# EAGLE design production (EAGLE 6.4)
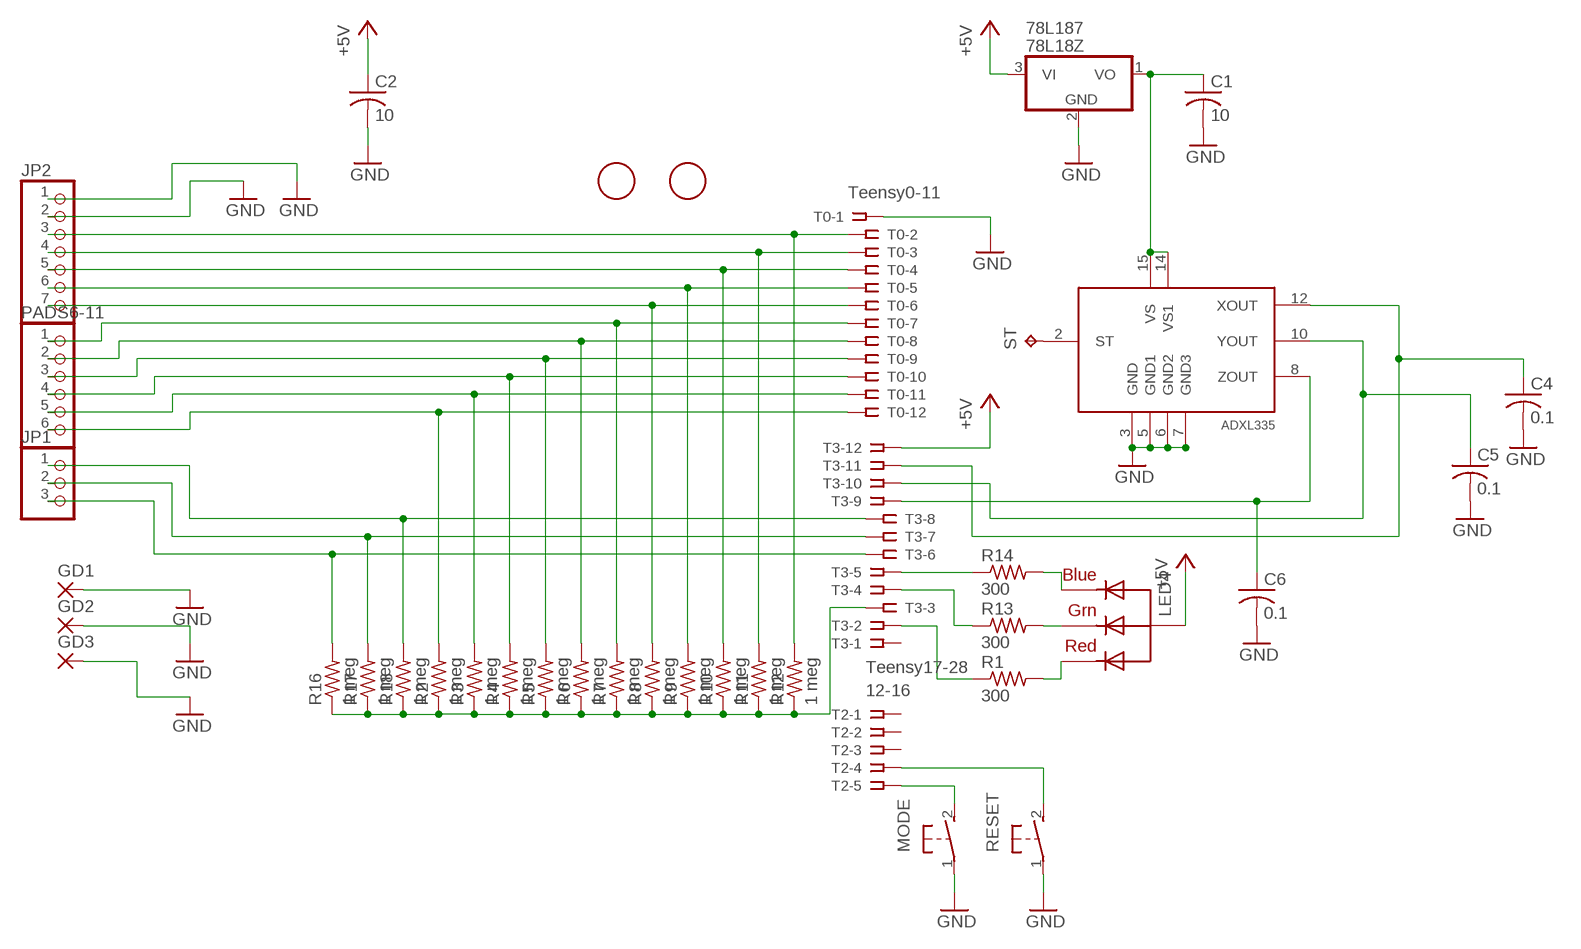
[diagram p0: schematic, sheet 1]

## Parts
78L187  78L18Z  [TO92]
ADXL335  ADXL33X  [16LCSP]
C1  10  C-US050-024X044  [C050-024X044]
C2  10  C-US050-024X044  [C050-024X044]
C4  0.1  C-US050-024X044  [C050-024X044]
C5  0.1  C-US050-024X044  [C050-024X044]
C6  0.1  C-US050-024X044  [C050-024X044]
FID1  FIDUCIAL  [FIDUCIAL_1MM]
FID2  FIDUCIAL  [FIDUCIAL_1MM]
GD1  3,17/1,1  [3,17/1,1]
GD2  3,17/1,1  [3,17/1,1]
GD3  3,17/1,1  [3,17/1,1]
JP1  PINHD-1X3  [1X03]
JP2  PINHD-1X7  [1X07]
LED4  RGBLED_CA-5MM  [LED5MMRGB]
MODE  31-XX  [B3F-31XX]
PADS6-11  PINHD-1X6  [1X06]
R1  300  R-US_0207/2V  [0207/2V]
R2  1 meg  R-US_0207/2V  [0207/2V]
R3  1 meg  R-US_0207/2V  [0207/2V]
R4  1 meg  R-US_0207/2V  [0207/2V]
R5  1 meg  R-US_0207/2V  [0207/2V]
R6  1 meg  R-US_0207/2V  [0207/2V]
R7  1 meg  R-US_0207/2V  [0207/2V]
R8  1 meg  R-US_0207/2V  [0207/2V]
R9  1 meg  R-US_0207/2V  [0207/2V]
R10  1 meg  R-US_0207/2V  [0207/2V]
R11  1 meg  R-US_0207/2V  [0207/2V]
R12  1 meg  R-US_0207/2V  [0207/2V]
R13  300  R-US_0207/2V  [0207/2V]
R14  300  R-US_0207/2V  [0207/2V]
R16  1 meg  R-US_0207/2V  [0207/2V]
R17  1 meg  R-US_0207/2V  [0207/2V]
R18  1 meg  R-US_0207/2V  [0207/2V]
RESET  31-XX  [B3F-31XX]
ST  TPTP17R  [TP17R]
T0  Teensy0-11  SSW-112-02-S-S  [SSW-112-02-S-S]
T2  12-16  SSW-105-02-S-S  [SSW-105-02-S-S]
T3  Teensy17-28  SSW-112-02-S-S  [SSW-112-02-S-S]

## Nets
+5V: 78L187.3(VI) C2.1 LED4.2(VCC) T3.12
GND: 78L187.2(GND) ADXL335.3(GND) ADXL335.5(GND1) ADXL335.6(GND2) ADXL335.7(GND3) C1.2 C2.2 C4.2 C5.2 C6.2 GD1.1(P) GD2.1(P) GD3.1(P) JP2.1 JP2.2 MODE.1(P) RESET.1(P) T0.1
N$1: JP2.3 R12.2 T0.2
N$2: JP2.4 R11.2 T0.3
N$3: PADS6-11.1 R7.2 T0.7
N$4: PADS6-11.2 R6.2 T0.8
N$5: PADS6-11.3 R5.2 T0.9
N$6: PADS6-11.4 R4.2 T0.10
N$7: PADS6-11.5 R3.2 T0.11
N$8: R14.1 T3.5
N$9: JP2.6 R9.2 T0.5
N$10: JP2.5 R10.2 T0.4
N$11: ADXL335.12(XOUT) C4.1 T3.11
N$12: PADS6-11.6 R2.2 T0.12
N$13: LED4.4(BLUE) R14.2
N$14: ADXL335.2(ST) ST.TP
N$16: ADXL335.8(ZOUT) C6.1 T3.9
N$17: LED4.3(GREEN) R13.2
N$18: JP1.3 R16.2 T3.6
N$19: JP1.2 R17.2 T3.7
N$20: JP1.1 R18.2 T3.8
N$21: R2.1 R3.1 R4.1 R5.1 R6.1 R7.1 R8.1 R9.1 R10.1 R11.1 R12.1 R16.1 R17.1 R18.1 T3.3
N$22: R13.1 T3.4
N$23: R1.1 T3.2
N$24: JP2.7 R8.2 T0.6
N$25: LED4.1(RED) R1.2
N$26: ADXL335.10(YOUT) C5.1 T3.10
N$27: MODE.2(S) T2.5
N$28: RESET.2(S) T2.4
VS1: 78L187.1(VO) ADXL335.14(VS1) ADXL335.15(VS) C1.1
Unconnected: T2.1 T2.2 T2.3 T3.1

## Library data of the parts
78L187 = adafruit:78*: Positive VOLTAGE REGULATOR Added bigger pads to the TO-92 package
ADXL335 = adafruit:ADXL33X
C1 C2 C4-C6 = adafruit:C-US: CAPACITOR, American symbol
FID1 FID2 = adafruit:FIDUCIAL: For use by pick and place machines to calibrate the vision/machine, 1mm By microbuilder.eu
GD1-GD3 = wirepad:3,17/1,1: THROUGH-HOLE PAD
JP1 = pinhead:PINHD-1X3: PIN HEADER
JP2 = pinhead:PINHD-1X7: PIN HEADER
LED4 = adafruit:RGBLED_CA: RGB LED, common-anode 5MM Staggered pins 5mm Piranha package http://www.ladyada.net/library/pcb/eaglelibrary.html
MODE RESET = switch-omron:31-XX: OMRON SWITCH; MPN: B3F-3100; OC_FARNELL: 959704; OC_NEWARK: 36M3582
PADS6-11 = pinhead:PINHD-1X6: PIN HEADER
R1-R14 R16-R18 = resistor:R-US_: RESISTOR, American symbol
ST = testpad:TP: Test pad
T0 T3 = con-samtec:SSW-112-02-S-S: THROUGH-HOLE .025" SQ POST SOCKET Source: Samtec SSW.pdf; MPN: SSW-112-02-S-S; OC_FARNELL: unknown; OC_NEWARK: 11P9515
T2 = con-samtec:SSW-105-02-S-S: THROUGH-HOLE .025" SQ POST SOCKET Source: Samtec SSW.pdf; MPN: SSW-105-02-S-S; OC_FARNELL: unknown; OC_NEWARK: 11P9399

## Net classes
0 default: clearance 0.355 mm

## Board
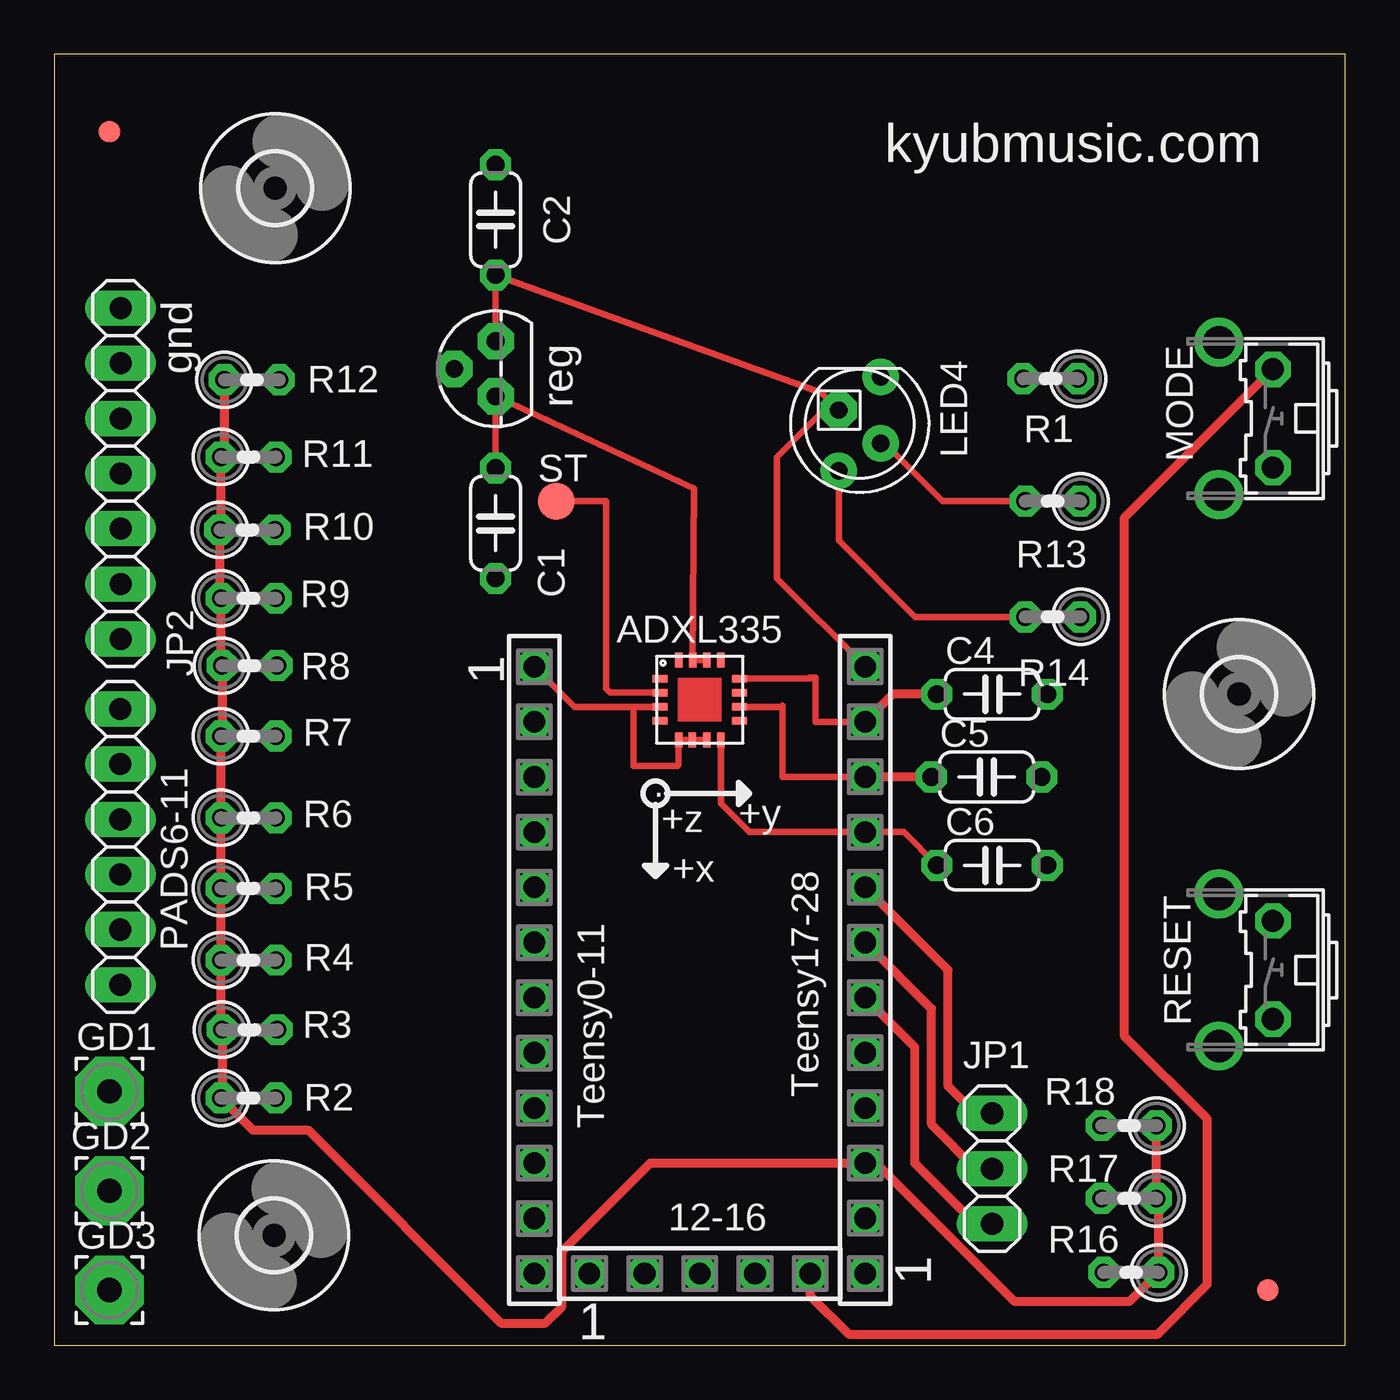
[diagram p1: board, top side]
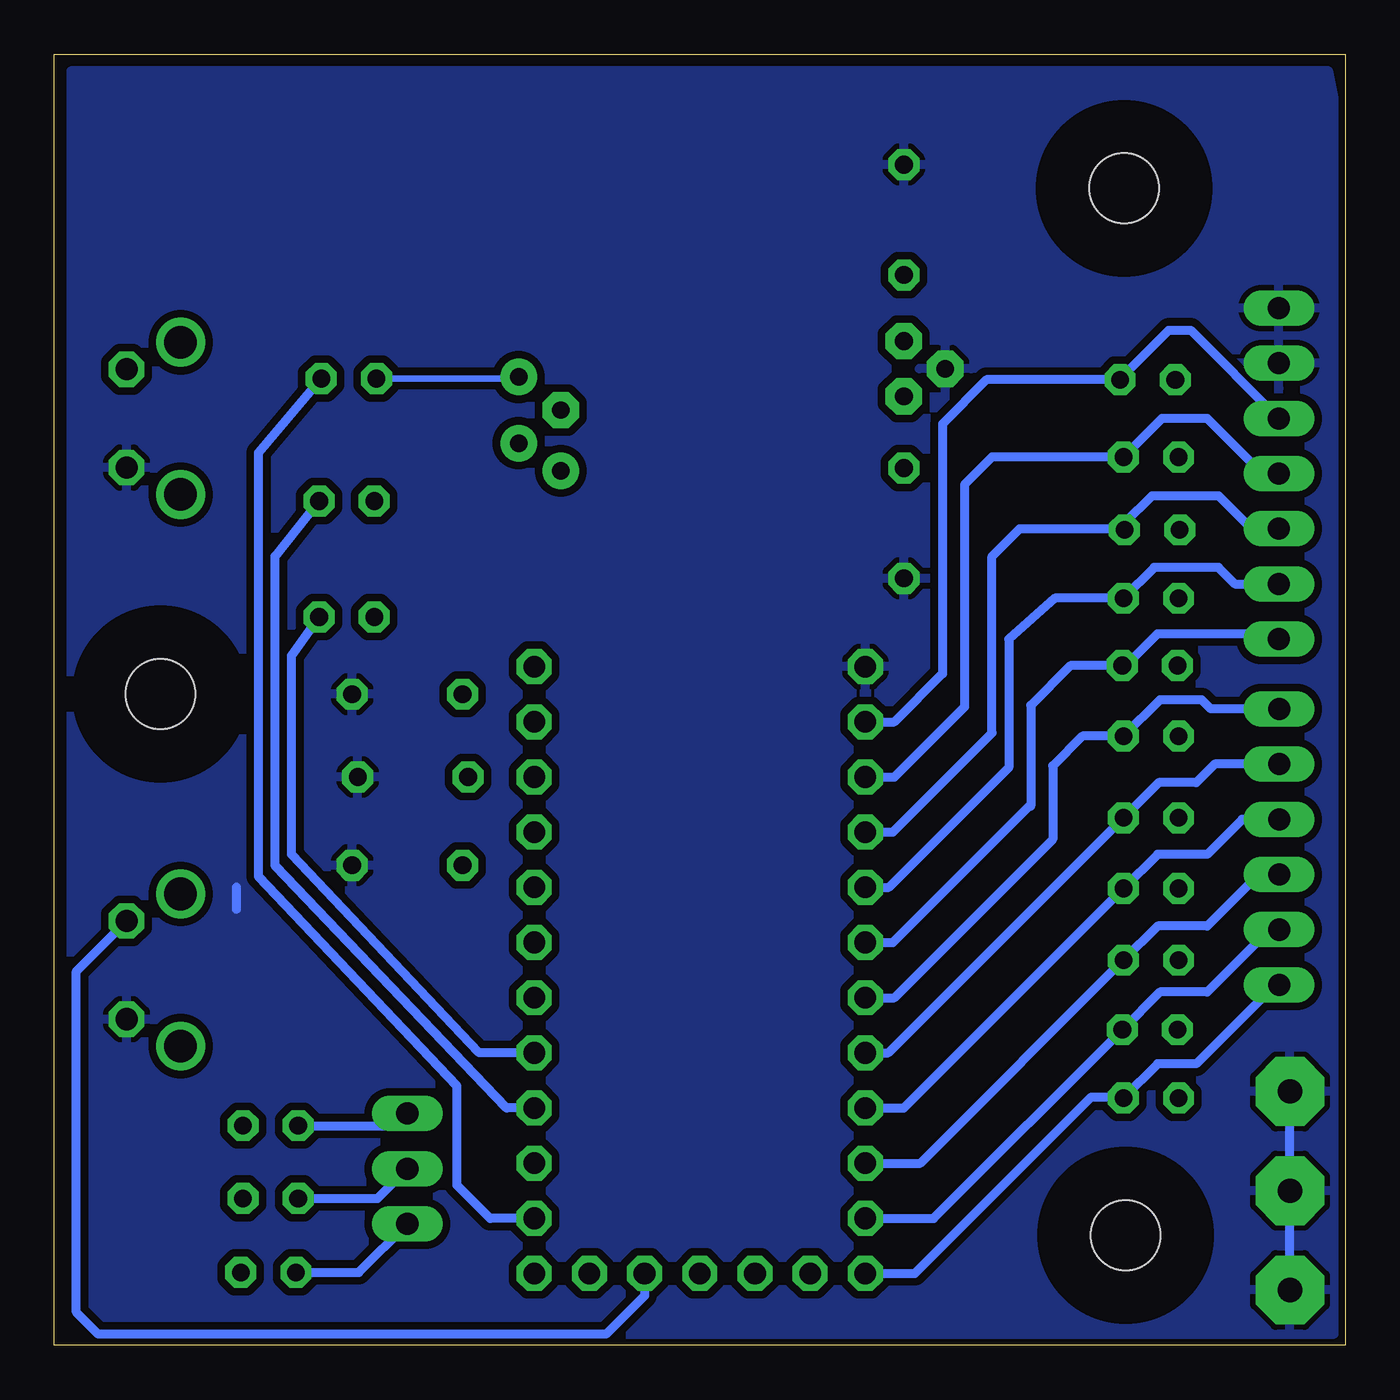
[diagram p2: board, bottom side, seen from below]

Size 59.44 x 59.44 mm. Coordinates in mm from the lower left corner, seen from the top.
Outline: 0,0 59.44,0 59.44,59.44 0,59.44 0,0
Copper layers (1*16): Top 0.035mm / dielectric 1.5mm / Bottom 0.035mm
Design rules "SparkFun": minimum track width 8mil, minimum drill 20mil, track to track 8mil, track to pad 8mil, pad to pad 8mil, via to via 8mil, smd to smd 8mil, copper to edge 10mil, drill to drill 8mil, minimum pad ring 12mil, minimum via ring 10mil, stop-mask expansion 4mil, vias tented up to drill 25mil, thermal gap 10mil

### Footprints (pad centres in the part's own frame; a part is rotated, then mirrored left to right if it is on the bottom)
TO92 = drill 0.813 pad 1.676 octagon: 1 -1.27,0; 2 0,1.905; 3 1.27,0
16LCSP = smd 0.7 x 0.35: 1 -1.825,0.975; 2 -1.825,0.325; 3 -1.825,-0.325; 4 -1.825,-0.975; 9 1.825,-0.975; 10 1.825,-0.325; 11 1.825,0.325; 12 1.825,0.975 | smd 0.35 x 0.7: 5 -0.975,-1.85; 6 -0.35,-1.85; 7 0.325,-1.85; 8 0.975,-1.85; 13 0.975,1.825; 14 0.325,1.825; 15 -0.325,1.825; 16 -0.975,1.825
C050-024X044 = drill 0.813 octagon: 1 -2.54,0; 2 2.54,0
FIDUCIAL_1MM = smd 1 x 1: 1 0,0
3,17/1,1 = drill 1.118 pad 3.175 octagon: 1 0,0
1X03 = drill 1.016 long: 1 -2.54,0; 2 0,0; 3 2.54,0
1X07 = drill 1.016 long: 1 -7.62,0; 2 -5.08,0; 3 -2.54,0; 4 0,0; 5 2.54,0; 6 5.08,0; 7 7.62,0
LED5MMRGB = drill 0.8 pad 1.676: 1 -2.159,0.968; 3 0.889,0.968; 4 2.159,-0.968 | drill 0.8 pad 1.676 octagon: 2 -0.635,-0.968
B3F-31XX = drill 1.016 octagon: 1 -2.261,-1.245; 2 2.261,-1.245 | drill 1.499 pad 2.159: 3 -3.505,1.245; 4 3.505,1.245
1X06 = drill 1.016 long: 1 -6.35,0; 2 -3.81,0; 3 -1.27,0; 4 1.27,0; 5 3.81,0; 6 6.35,0
0207/2V = drill 0.813 octagon: 1 -1.27,0; 2 1.27,0
TP17R = smd 1.7 x 1.7: TP 0,0
SSW-112-02-S-S = drill 1 pad 1.5 octagon: 1 -13.97,0; 2 -11.43,0; 3 -8.89,0; 4 -6.35,0; 5 -3.81,0; 6 -1.27,0; 7 1.27,0; 8 3.81,0; 9 6.35,0; 10 8.89,0; 11 11.43,0; 12 13.97,0
SSW-105-02-S-S = drill 1 pad 1.5 octagon: 1 -5.08,0; 2 -2.54,0; 3 0,0; 4 2.54,0; 5 5.08,0
3,2 = hole 3.2: 0,0

### Placement (x,y rotation side)
78L187  20.32,44.96 90 top
ADXL335  29.72,29.72 0 top
C1  20.32,37.85 270 top
C2  20.32,51.82 90 top
C4  43.18,29.97 0 top
C5  42.93,26.16 0 top
C6  43.18,22.1 0 top
FID1  2.54,55.88 0 top
FID2  55.88,2.54 0 top
GD1  2.54,11.68 0 top
GD2  2.54,7.11 0 top
GD3  2.54,2.54 0 top
JP1  43.18,8.13 270 top
JP2  3.05,40.13 270 top
LED4  37.08,42.42 270 top
MODE  54.86,42.67 90 top
PADS6-11  3.04,22.94 270 top
R1  45.87,44.5 180 top
R2  8.94,11.38 0 top
R3  8.99,14.53 0 top
R4  8.94,17.73 0 top
R5  8.94,21.03 0 top
R6  8.94,24.28 0 top
R7  8.94,28.04 0 top
R8  8.99,31.29 0 top
R9  8.94,34.39 0 top
R10  8.89,37.54 0 top
R11  8.94,40.89 0 top
R12  9.09,44.45 0 top
R13  45.97,38.86 180 top
R14  45.97,33.53 180 top
R16  49.58,3.35 180 top
R17  49.48,6.76 180 top
R18  49.48,10.11 180 top
RESET  54.86,17.27 90 top
ST  23.11,38.86 0 top
T0  22.1,17.27 270 top
T2  29.72,3.3 0 top
T3  37.34,17.27 90 top
U$3  1/8 hole for M3 screw  [3,2]  10.17,53.27 0 top
U$4  1/8 hole for M3 screw  [3,2]  10.12,5.06 0 top
U$5  1/8 hole for M3 screw  [3,2]  54.55,29.98 0 top

### Tracks (layer width: path | path; a pad name or v marks a point on that pad's centre or on a via)
+5V
  Top 0.203: 36.07,43.18 LED4.2
  Top 0.305: 78L187.3 C2.1 35.31,43.86 LED4.2 35.43,43.05 33.27,40.89 33.27,35.31 T3.12
GND
  Top 0.203: ADXL335.6 29.46,27.94 29.46,27.87
  Top 0.305: ADXL335.3 26.67,29.39 | 26.67,29.39 23.95,29.39 T0.1 | ADXL335.7 29.46,27.87 ADXL335.6 ADXL335.5 28.74,26.71 28.7,26.67 26.67,26.67 26.67,29.39
  Bottom 0.406: GD3.1 GD2.1 GD1.1 | 51.05,21.08 51.05,20.07
  pour Bottom: 0.76,58.67 58.67,58.67 58.67,0.51 0.51,0.51 0.51,57.4
N$1
  Bottom 0.406: T0.2 20.76,28.7 18.54,30.92 18.54,42.42 16.51,44.45 R12.2 10.36,44.5 8.13,46.74 7.11,46.74 JP2.3
N$2
  Bottom 0.203: JP2.4 4.06,40.13 4.32,40.39 4.21,40.53
  Bottom 0.406: 4.21,40.53 6.35,42.67 8.43,42.67 R11.2 16.26,40.89 17.53,39.62 17.53,29.39 20.76,26.16 T0.3
N$3
  Bottom 0.406: PADS6-11.1 6.18,29.29 6.6,29.72 8.53,29.72 R7.2 12.09,28.04 13.46,26.67 13.46,23.3 20.76,16 T0.7
N$4
  Bottom 0.406: R6.2 10.21,24.01 | PADS6-11.2 6.01,26.75 6.86,25.91 8.59,25.91 R6.2 | T0.8 21.03,13.46 R6.2
N$5
  Bottom 0.406: PADS6-11.3 4.74,24.21 6.35,22.61 8.64,22.61 R5.2 20.32,10.92 T0.9
N$6
  Bottom 0.406: PADS6-11.4 3.98,21.67 6.35,19.3 8.64,19.3 R4.2 19.56,8.38 T0.10
N$7
  Bottom 0.406: PADS6-11.5 3.47,19.13 6.35,16.26 8.53,16.26 R3.2 18.95,5.84 T0.11
N$8
  Bottom 0.406: T3.5 39.88,13.46 48.51,22.61 48.51,31.75 R14.1
N$9
  Bottom 0.406: T0.5 21.01,21.08 15.49,26.6 15.49,32.51 13.36,34.39 R9.2 8.79,35.81 5.84,35.81 5.08,35.05 JP2.6
N$10
  Bottom 0.406: JP2.5 4.32,37.59 5.84,39.12 8.89,39.12 10.16,37.85 R10.2 10.21,37.59 14.99,37.59 16.26,36.32 16.26,28.19 20.83,23.62 T0.4
N$11
  Top 0.305: ADXL335.12 34.8,30.69 34.8,30.73 35.05,30.73 35.05,28.7 T3.11
  Top 0.406: C4.1 38.61,29.97 T3.11
N$12
  Bottom 0.406: PADS6-11.6 3.55,16.26 6.86,12.95 8.64,12.95 R2.2 10.26,11.43 11.68,11.43 19.81,3.3 T0.12
N$13
  Top 0.305: LED4.4 36.12,37.04 39.62,33.53 R14.2
N$14
  Top 0.305: ST.TP 25.4,38.86 25.4,30.23 25.58,30.04 ADXL335.2
N$16
  Top 0.305: ADXL335.8 30.69,24.93 32,23.62 T3.9 39.12,23.62 C6.1
N$17
  Top 0.305: LED4.3 38.23,41.53 40.89,38.86 R13.2
N$18
  Top 0.406: JP1.3 42.42,5.59 39.62,8.38 39.62,13.72 T3.6
  Bottom 0.406: R16.2 45.41,3.35 JP1.3
N$19
  Top 0.406: JP1.2 42.42,8.13 40.39,10.16 40.39,15.49 T3.7
  Bottom 0.406: R17.2 44.55,6.76 JP1.2
N$20
  Top 0.406: JP1.1 42.42,10.67 41.15,11.94 41.15,17.27 T3.8
  Bottom 0.406: R18.2 43.74,10.11 JP1.1
N$21
  Top 0.406: R12.1 7.82,41.05 R11.1 7.67,37.13 7.62,37.08 R10.1 7.62,34.44 R9.1 7.67,31.34 R8.1 7.72,28.09 R7.1 R6.1 R5.1 R4.1 7.67,14.58 R3.1 7.72,11.43 R2.1 9.14,9.91 11.68,9.91 20.57,1.02 22.61,1.02 23.37,1.78 23.37,4.32 27.43,8.38 T3.3 37.85,8.38 44.2,2.03 49.53,2.03 R16.1 50.85,6.66 R17.1 R18.1
N$22
  Bottom 0.406: R13.1 49.28,36.32 49.28,22.1 38.61,10.92 T3.4
N$23
  Bottom 0.406: R1.1 50.04,41.1 50.04,21.59 40.89,11.94 40.89,7.37 39.37,5.84 T3.2
N$24
  Bottom 0.406: 14.48,24.89 14.48,29.46 12.65,31.29 R8.2 10.11,31.29 8.64,32.77 3.3,32.77 JP2.7 | 14.48,24.89 14.48,24.82 | T0.6 20.83,18.54 14.48,24.89
N$25
  Bottom 0.305: 38.13,44.5 R1.2
  Bottom 0.406: 38.13,44.5 LED4.1
N$26
  Top 0.305: ADXL335.10 33.53,29.39 | 33.53,29.39 33.53,29.46 | 33.53,29.39 33.53,26.16 T3.10
  Top 0.406: C5.1 T3.10
N$27
  Top 0.406: T2.5 34.8,2.29 36.58,0.51 50.8,0.51 53.09,2.79 53.09,10.41 49.28,14.22 49.28,38.1 MODE.2
N$28
  Bottom 0.406: T2.4 32.26,2.29 34.04,0.51 57.4,0.51 58.42,1.52 58.42,17.22 RESET.2
VS1
  Top 0.203: 29.97,31.75 ADXL335.14
  Top 0.305: ADXL335.14 ADXL335.15 29.46,39.44 78L187.1 C1.1

### Text on the board
tPlace: kyubmusic.com | gnd | reg | . | +z | +y | +x